# EAGLE design street_lighting v1 (EAGLE 9.7.0)
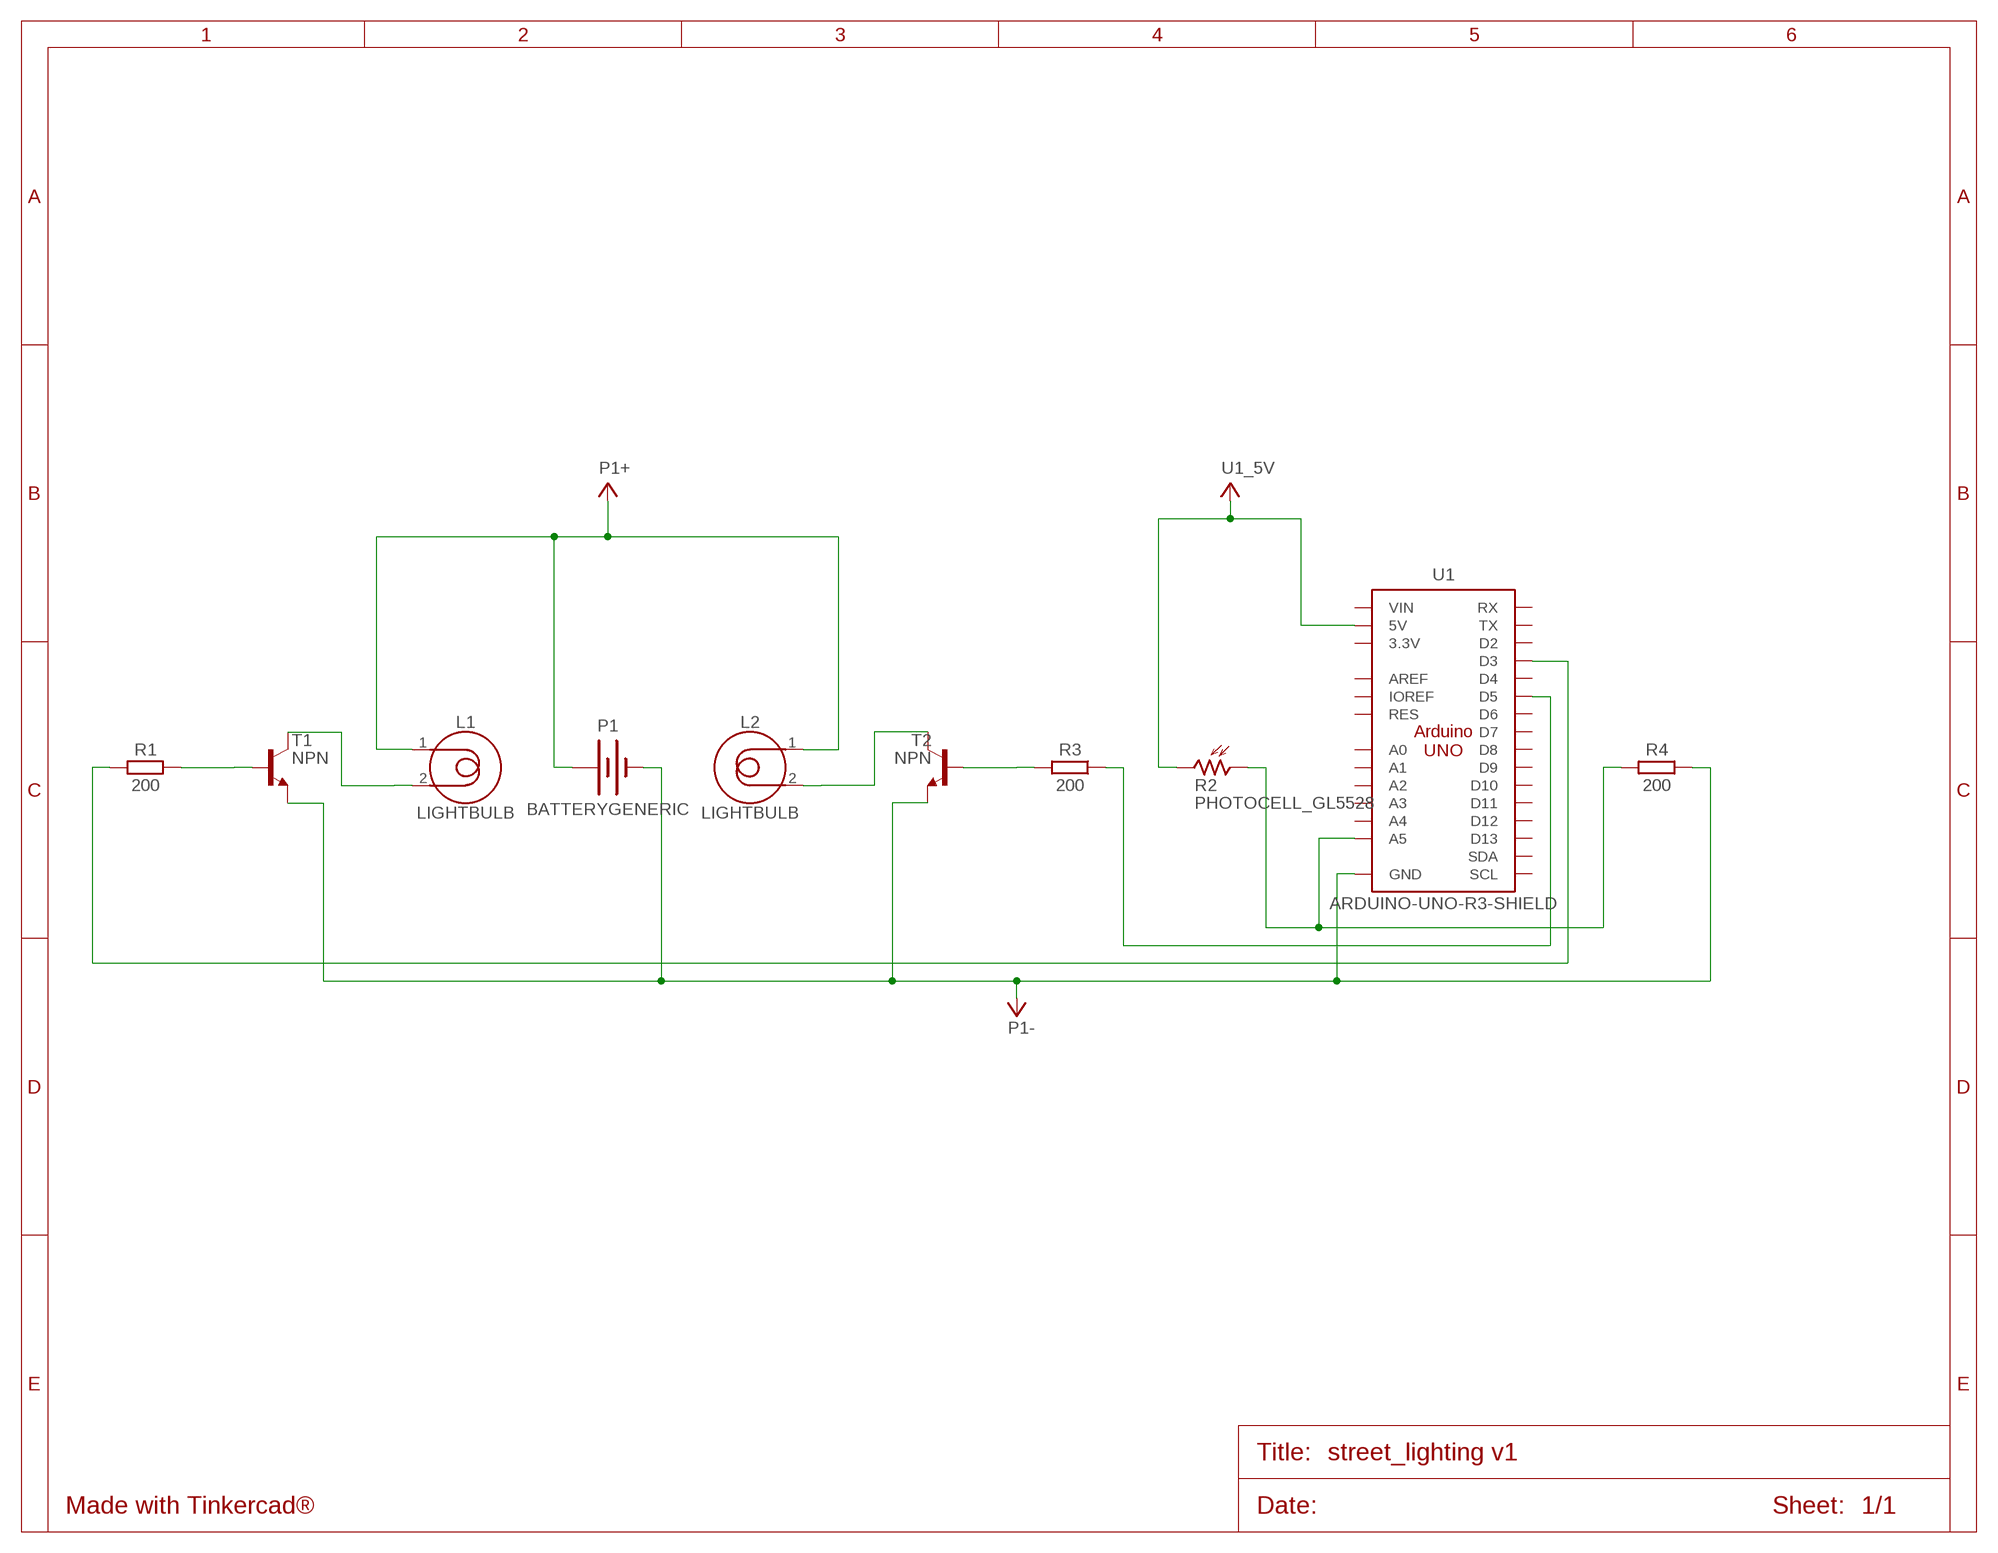
[diagram p0: schematic, sheet 1]

## Parts
L1  LIGHTBULB  [1X02]
L2  LIGHTBULB  [1X02]
P1  BATTERYGENERIC  [BATTERY-GENERIC]
R1  200  RESISTOR_AXIAL-10.16MM-PITCH  [RESAD1016W63L850D250B]
R2  PHOTOCELL_GL5528  [GL5528]
R3  200  RESISTOR_AXIAL-10.16MM-PITCH  [RESAD1016W63L850D250B]
R4  200  RESISTOR_AXIAL-10.16MM-PITCH  [RESAD1016W63L850D250B]
T1  NPN  NPN__TO92  [TO92]
T2  NPN  NPN__TO92  [TO92]
U1  ARDUINO-UNO-R3-SHIELD  [ARDUINO-UNO-R3-SHIELD]

## Nets
L1_2: L1.2 T1.1(C)
L2_2: L2.2 T2.1(C)
P1+: L1.1 L2.1 P1.+
P1-: P1.- R4.1 T1.3(E) T2.3(E) U1.GND@0(GND) U1.GND@1(GND) U1.GND@2(GND)
T1_B: R1.2 T1.2(B)
T2_B: R3.2 T2.2(B)
U1_5V: R2.2 U1.5V
U1_A5: R2.1 R4.2 U1.A5
U1_D3: R1.1 U1.D3
U1_D5: R3.1 U1.D5
Unconnected: U1.3.3V U1.A0 U1.A1 U1.A2 U1.A3 U1.A4 U1.AREF U1.D2 U1.D4 U1.D6 U1.D7 U1.D8 U1.D9 U1.D10 U1.D11 U1.D12 U1.D13 U1.IOREF U1.RES U1.RX U1.SCL U1.SDA U1.TX U1.VIN

## Library data of the parts
L1 L2 = Tinkercad:LIGHTBULB
P1 = Tinkercad:BATTERY
R1 R3 R4 = Tinkercad:RESISTOR: Resistor Fixed - Generic
R2 = Tinkercad:PHOTOCELL: Photoresistor / Photoconductive cells Reference Datasheet <https://www.sunrom.com/get/753444>
T1 T2 = Tinkercad:NPN: NPN - Generic; CATEGORY: Transistor; SUB-CATEGORY: BJT; TYPE: NPN
U1 = Tinkercad:ARDUINO-UNO-R3-SHIELD

## Board
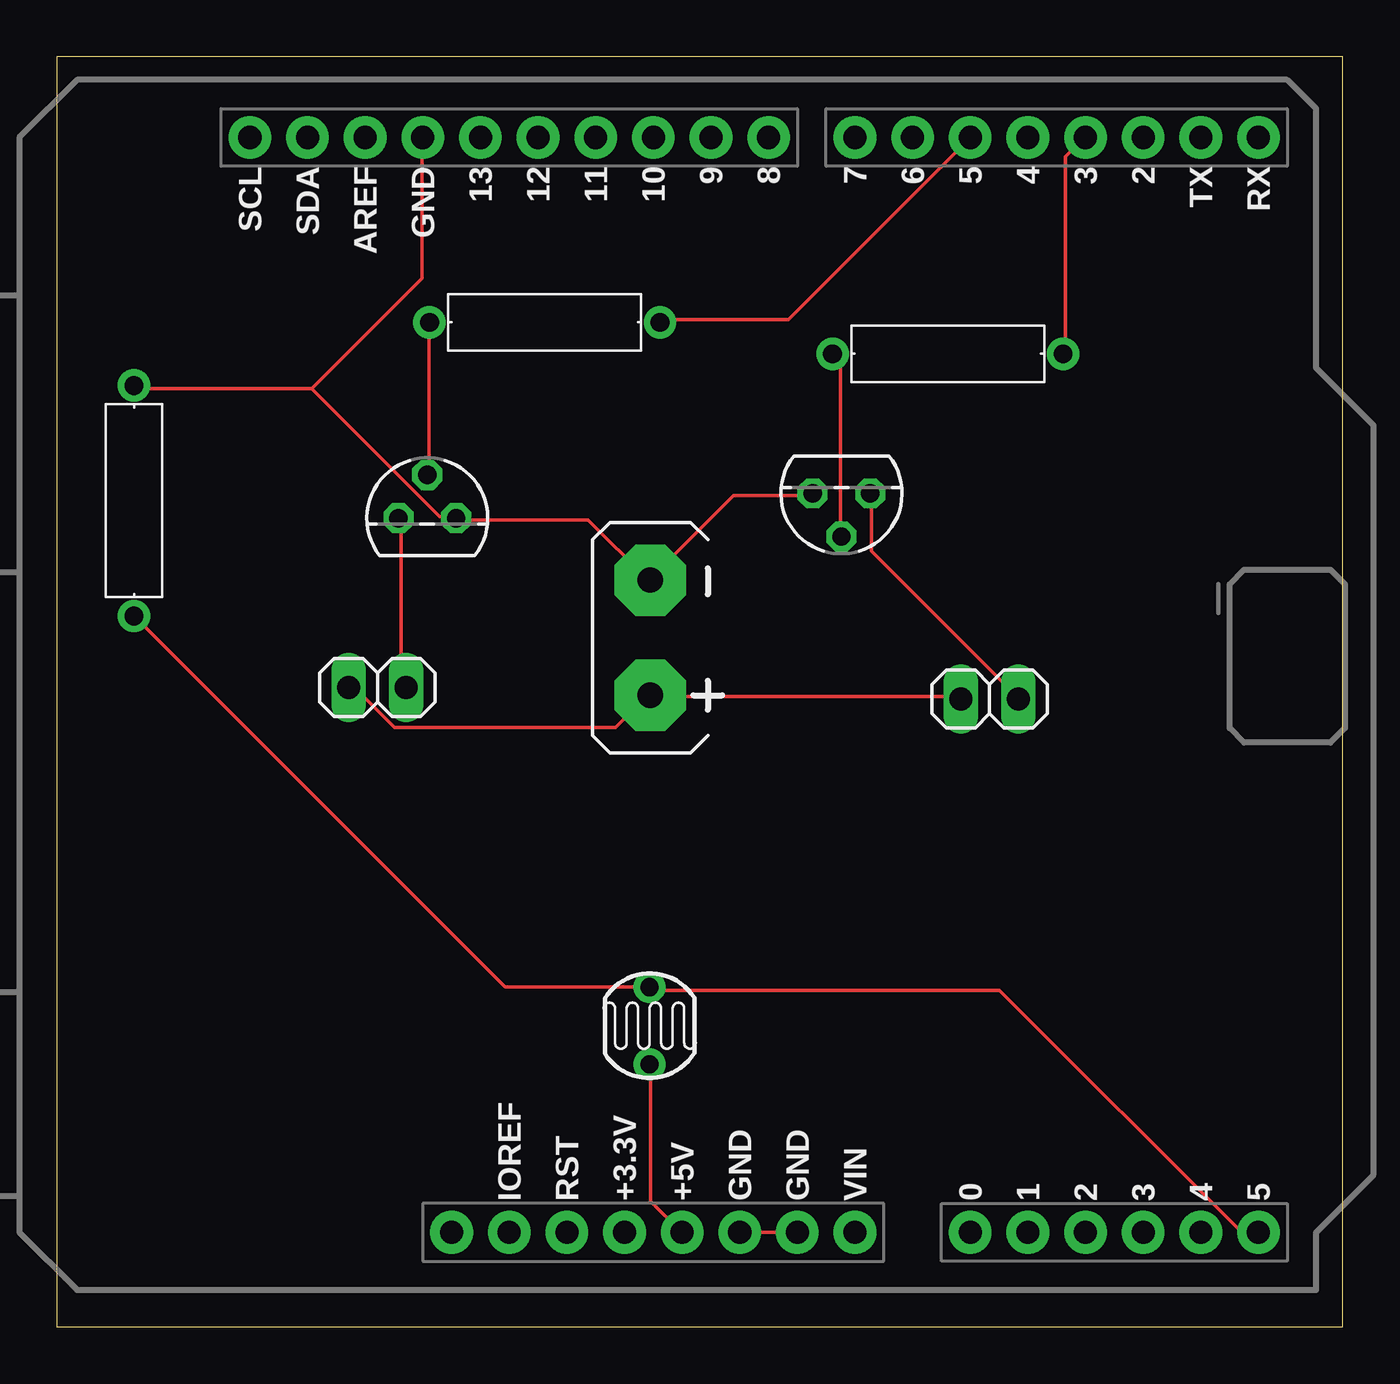
[diagram p1: board, top side]
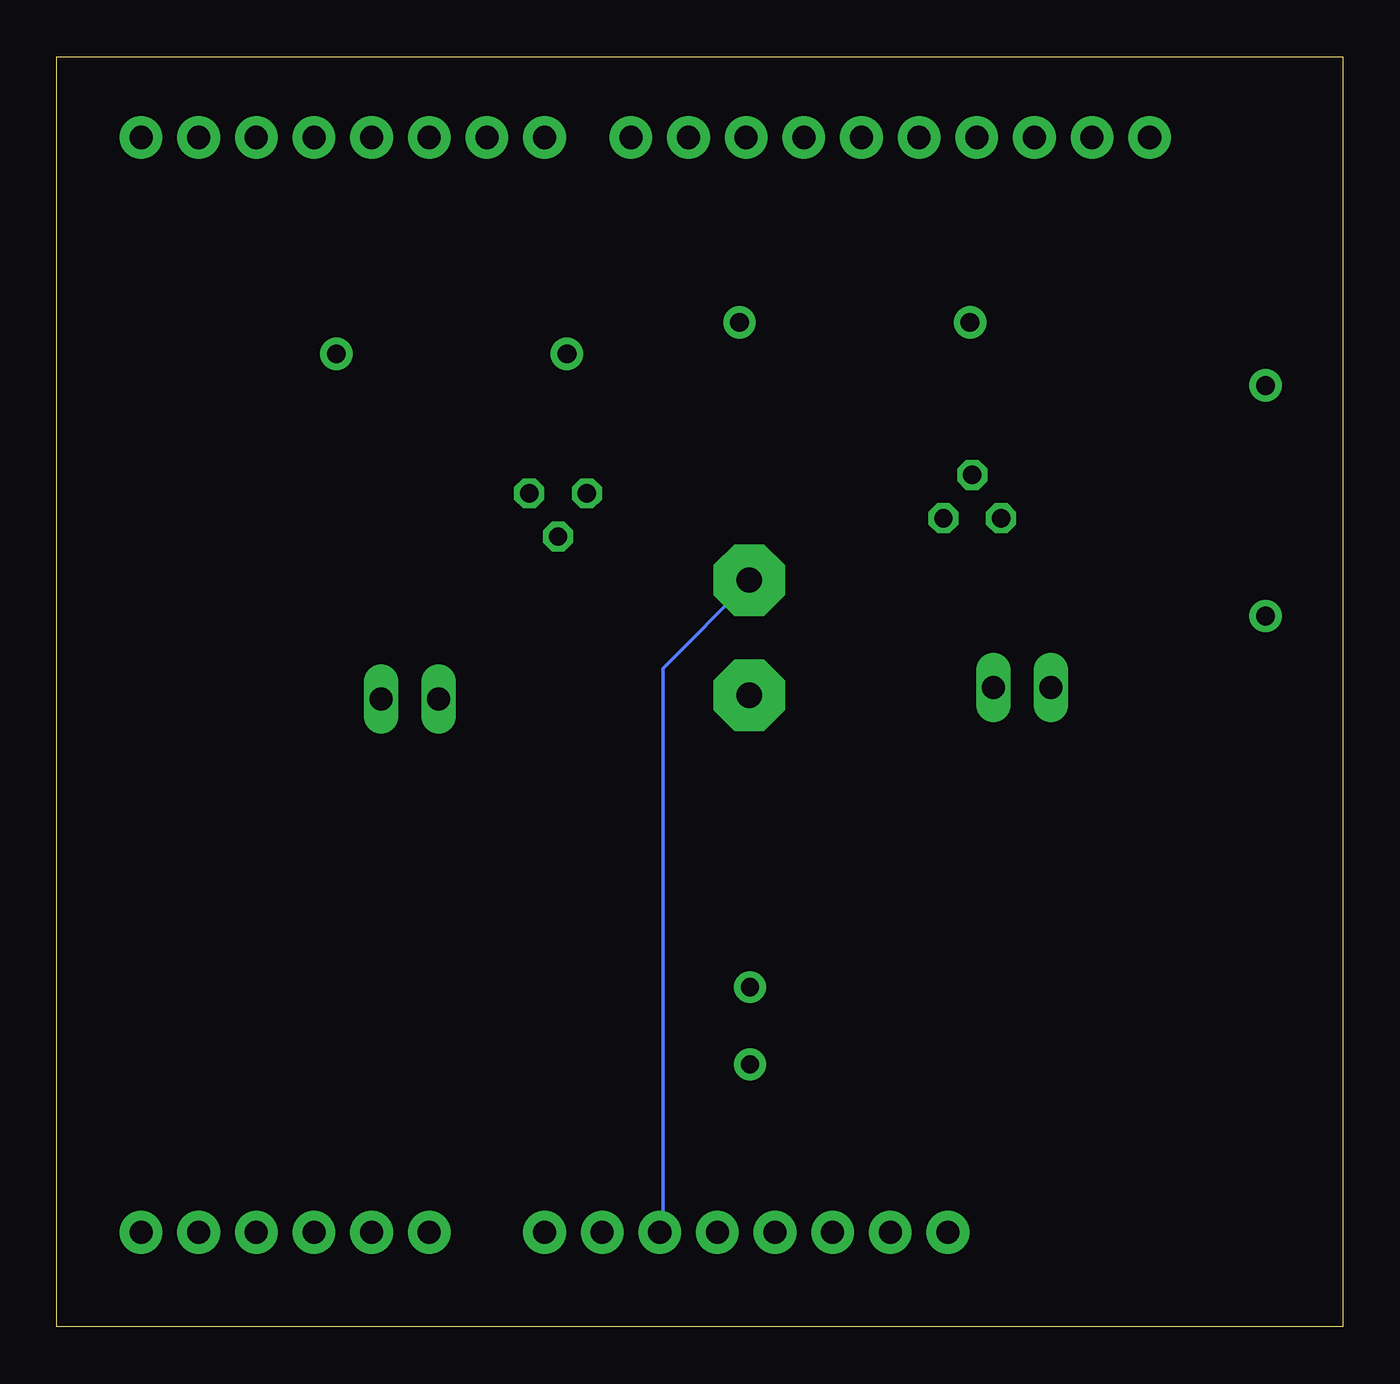
[diagram p2: board, bottom side, seen from below]

Size 56.68 x 55.98 mm. Coordinates in mm from the lower left corner, seen from the top.
Outline: 0,0 56.68,0 56.68,55.98 0,55.98 0,0
Copper layers (1*16): Top 0.035mm / dielectric 1.5mm / Bottom 0.035mm
Design rules "default": minimum track width 6mil, minimum drill 0.35mm, track to track 6mil, track to pad 6mil, pad to pad 6mil, via to via 6mil, smd to smd 6mil, copper to edge 40mil, drill to drill 6mil, minimum pad ring 10mil, minimum via ring 8mil, stop-mask expansion 4mil, vias tented up to drill 0mil, thermal gap 10mil

### Footprints (pad centres in the part's own frame; a part is rotated, then mirrored left to right if it is on the bottom)
1X02 = drill 1.016 long: 1 -1.27,0; 2 1.27,0
BATTERY-GENERIC = drill 1.118 pad 3.15 octagon: + 2.54,0; - -2.54,0
RESAD1016W63L850D250B = drill 0.83 pad 1.43: 1 -5.08,0; 2 5.08,0
GL5528 = drill 0.8 pad 1.4: 1 -1.702,0; 2 1.702,0
TO92 = drill 0.813 octagon: 1 -1.27,0; 2 0,1.905; 3 1.27,0
ARDUINO-UNO-R3-SHIELD = drill 1.016 pad 1.88: 3.3V 24.13,-2.54; 5V 24.13,0; A0 24.13,12.7; A1 24.13,15.24; A2 24.13,17.78; A3 24.13,20.32; A4 24.13,22.86; A5 24.13,25.4; AREF -24.13,-13.97; D2 -24.13,20.32; D3 -24.13,17.78; D4 -24.13,15.24; D5 -24.13,12.7; D6 -24.13,10.16; D7 -24.13,7.62; D8 -24.13,3.81; D9 -24.13,1.27; D10 -24.13,-1.27; D11 -24.13,-3.81; D12 -24.13,-6.35; D13 -24.13,-8.89; GND@0 24.13,2.54; GND@1 24.13,5.08; GND@2 -24.13,-11.43; IOREF 24.13,-7.62; NC 24.13,-10.16; RES 24.13,-5.08; RX -24.13,25.4; SCL -24.13,-19.05; SDA -24.13,-16.51; TX -24.13,22.86; VIN 24.13,7.62

### Placement (x,y rotation side)
L1  41.12,27.67 0 top
L2  14.14,28.18 0 top
P1  26.16,30.37 270 top
R1  39.28,42.88 180 top
R2  26.13,13.27 270 top
R3  21.51,44.27 180 top
R4  3.4,36.41 270 top
T1  34.59,36.74 180 top
T2  16.33,35.64 0 top
U1  27.56,28.29 270 top

### Tracks (layer width: path | path; a pad name or v marks a point on that pad's centre or on a via)
L1_2
  Top 0.152: T1.1 35.92,36.63 35.92,34.19 42.32,27.79 L1.2
L2_2
  Top 0.152: T2.1 15.19,35.56 15.19,28.4 15.34,28.25 L2.2
P1+
  Top 0.152: L1.1 39.73,27.79 26.16,27.79 P1.+ 26.01,27.79 24.64,26.42 14.88,26.42 13.21,28.09 12.9,28.09 L2.1
P1-
  Top 0.152: U1.GND@0 30.12,4.17 32.56,4.17 U1.GND@1 | T1.3 33.17,36.63 29.82,36.63 26.16,32.97 P1.- 26.01,32.97 23.42,35.56 17.63,35.56 T2.3 17.48,35.71 16.87,35.71 11.23,41.35 | 11.23,41.35 3.45,41.35 R4.1 | 11.23,41.35 16.1,46.23 16.1,52.32 U1.GND@2
  Bottom 0.152: U1.GND@0 29.97,4.17 29.97,29.01 26.16,32.82 P1.-
T1_B
  Top 0.152: T1.2 34.54,34.95 34.54,42.57 34.24,42.88 R1.2
T2_B
  Top 0.152: T2.2 16.41,37.69 16.41,44.25 R3.2
U1_5V
  Top 0.152: R2.2 26.16,11.48 26.16,5.54 27.53,4.17 U1.5V
U1_A5
  Top 0.152: R4.2 3.45,31.29 19.76,14.99 26.01,14.99 R2.1 26.16,14.83 41.55,14.83 52.22,4.17 52.83,4.17 U1.A5
U1_D3
  Top 0.152: R1.1 44.45,43.03 44.45,51.56 45.21,52.32 U1.D3
U1_D5
  Top 0.152: R3.1 26.62,44.4 32.26,44.4 40.18,52.32 U1.D5